# EasyEDA Pro project stm32_无人机.eprj, schematic 飞控板

## Sheets
1 MCU: Board Name: Board1; Create Date: 2025-11-24; Page Name: MCU; Project Name: stm32_无人机; Schematic Name: 飞控板; Update Date: 2025-11-25; Company: 嘉立创EDA; Page Size: A4; Version: V1.0
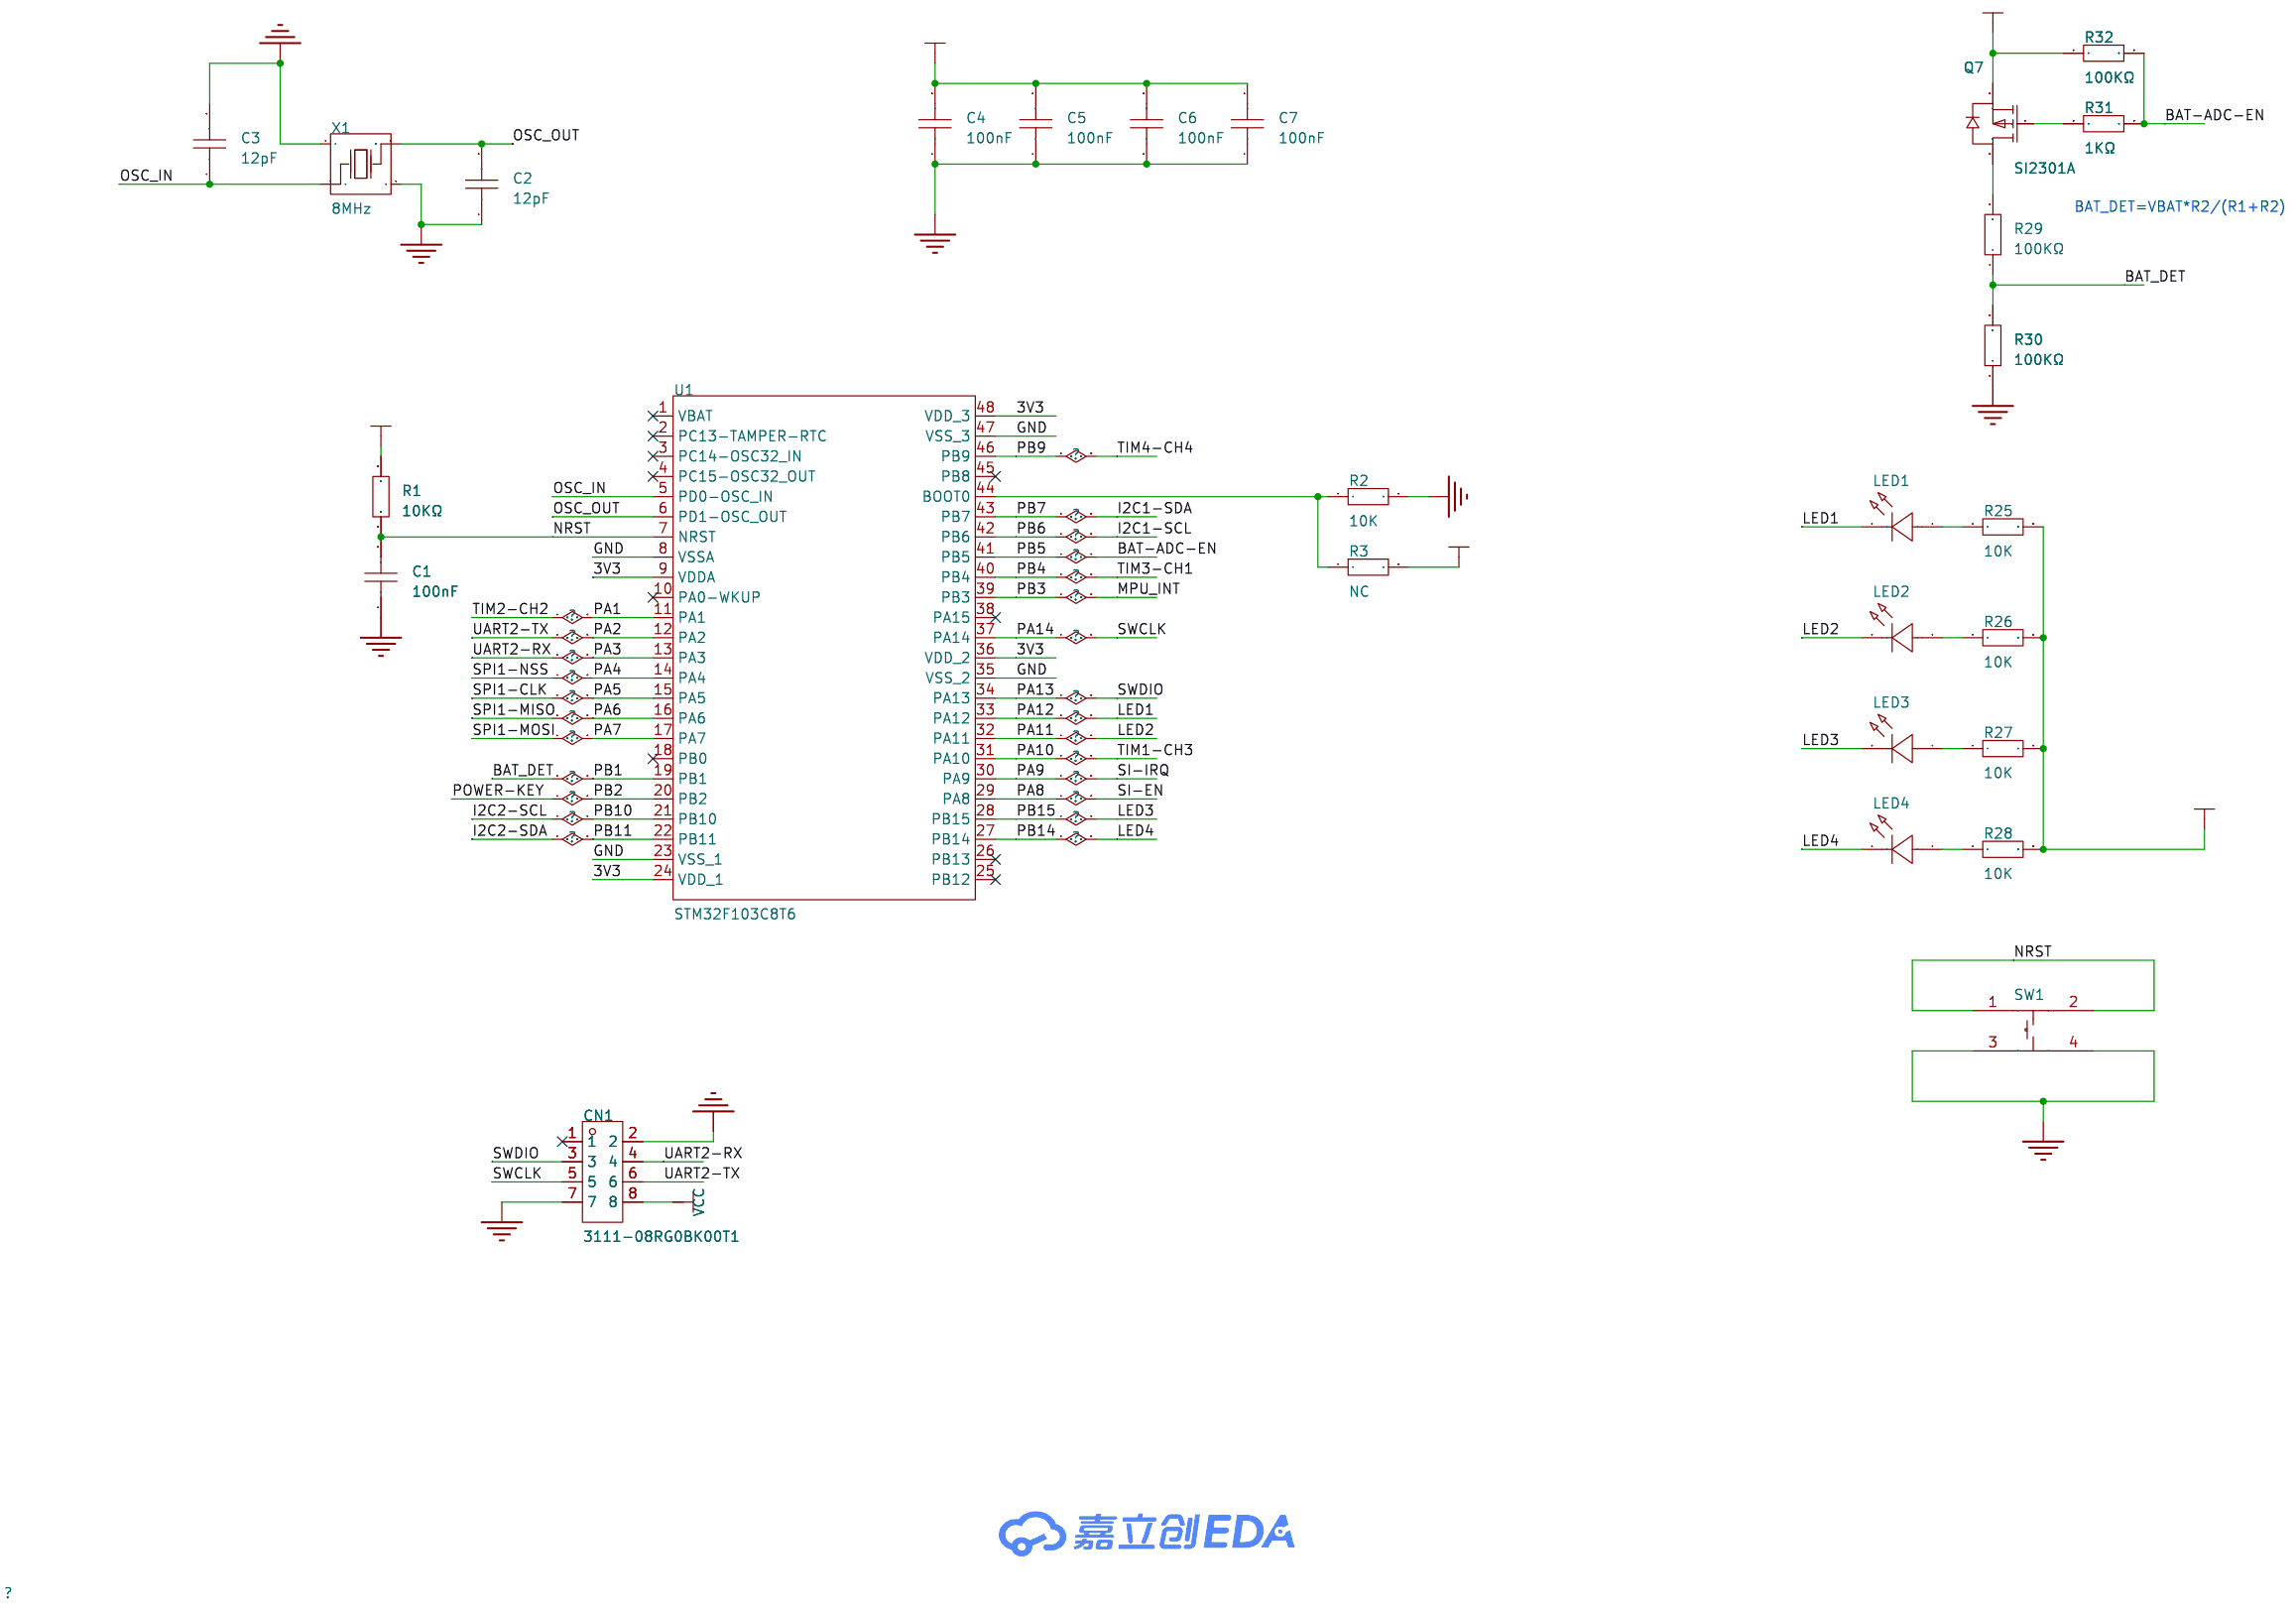
[diagram p0: MCU]
2 MPU6050: Create Date: 2025-11-25; Page Name: MPU6050
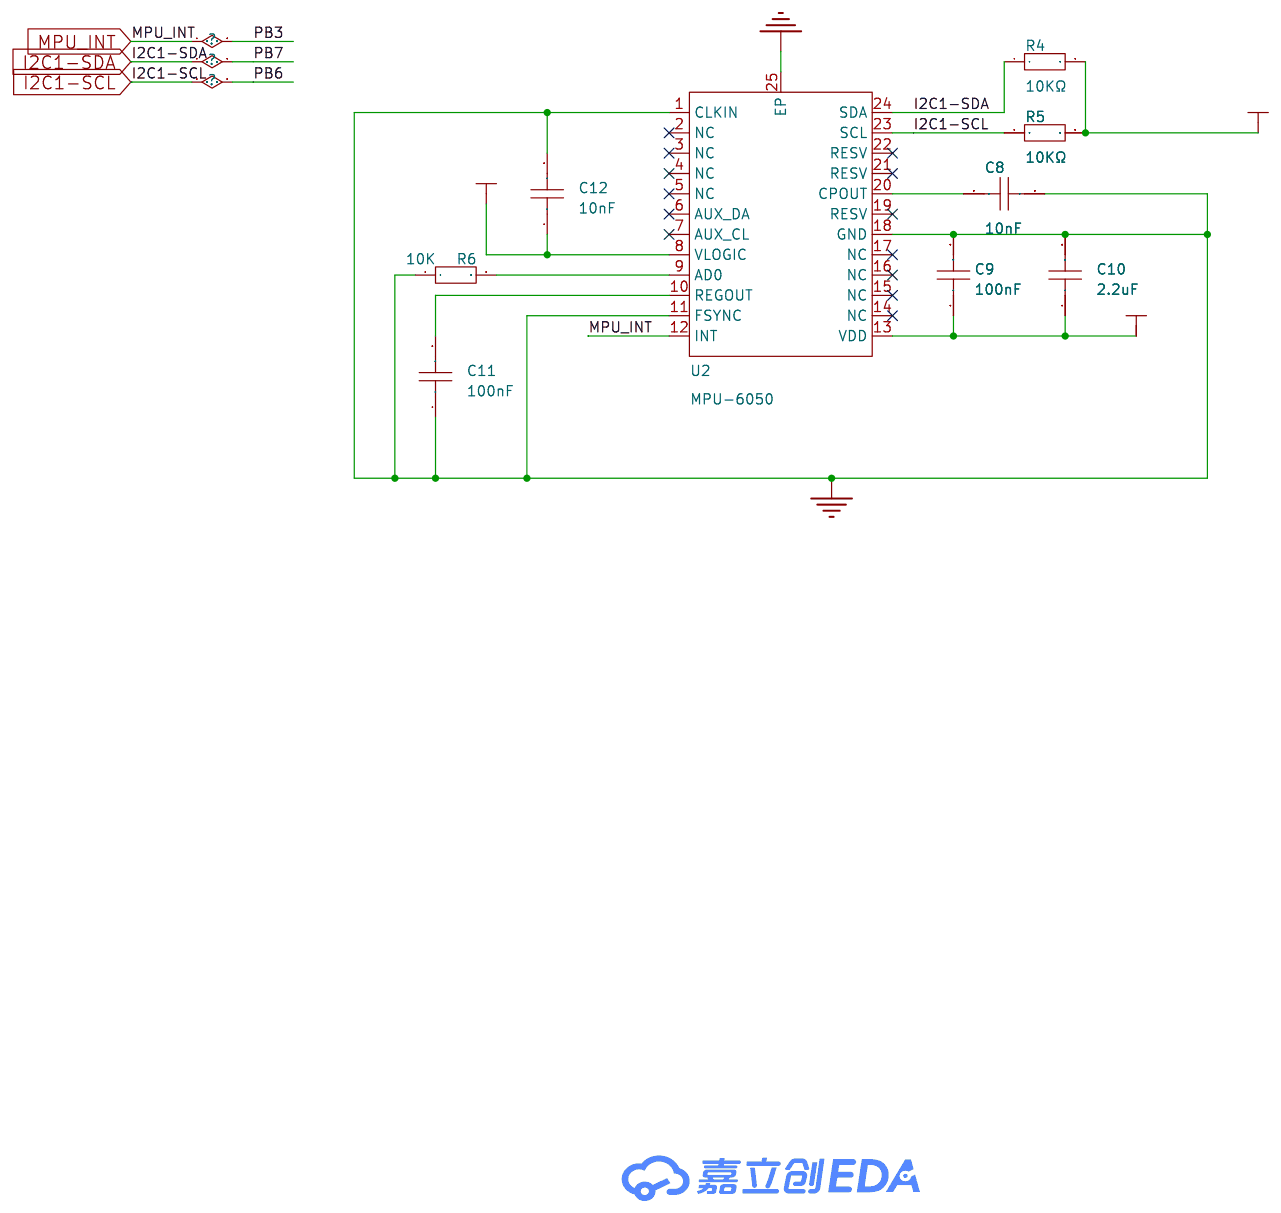
[diagram p1: MPU6050]
3 SI24R1: Create Date: 2025-11-25; Page Name: SI24R1
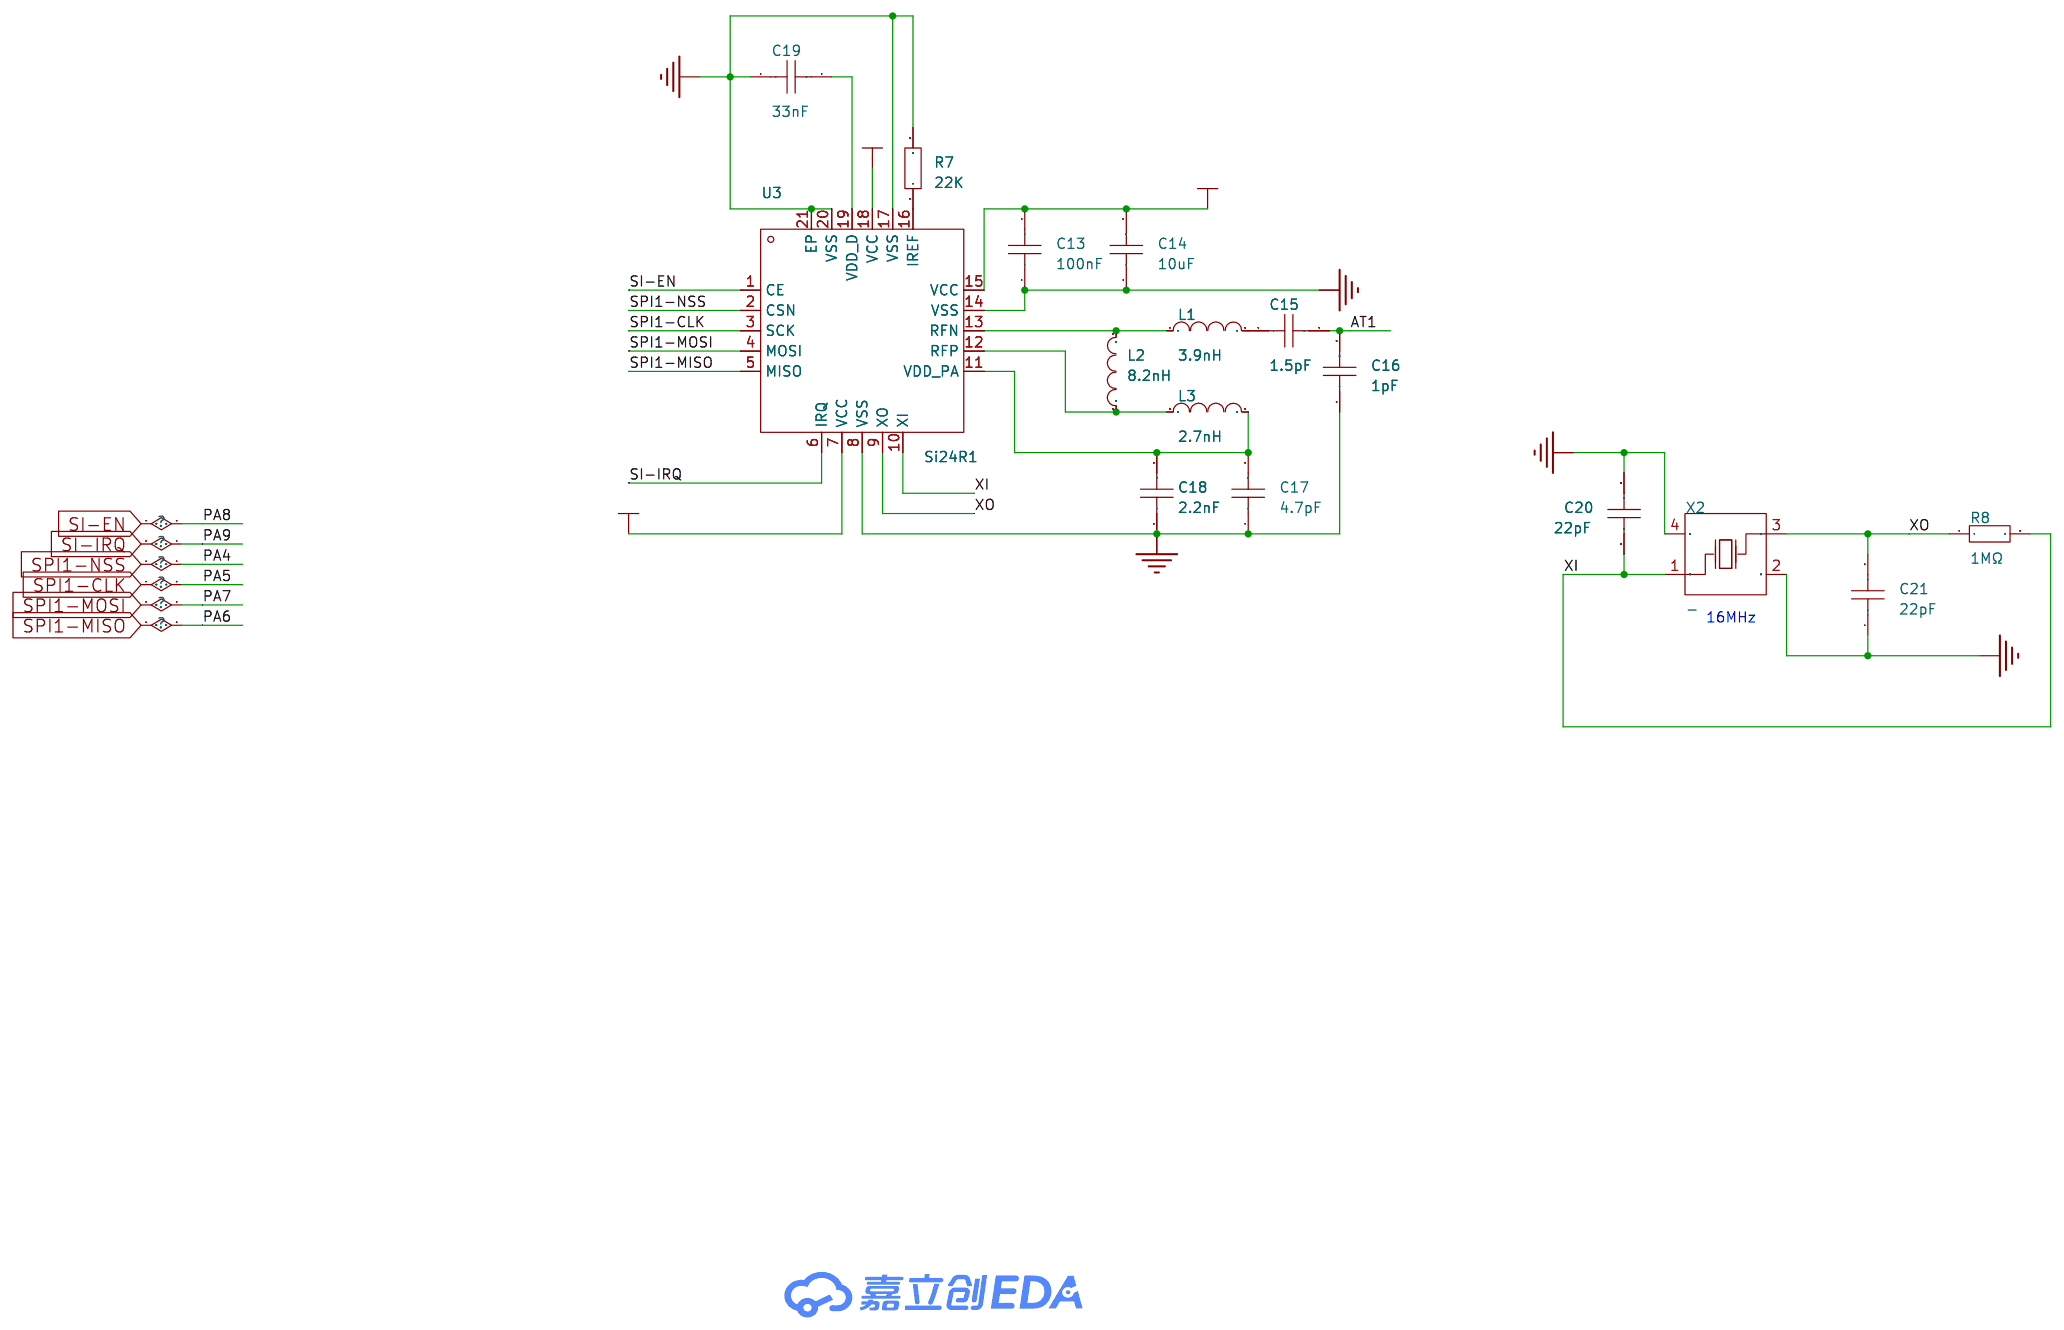
[diagram p2: SI24R1]
4 激光测高VL53: Create Date: 2025-11-25; Page Name: 激光测高VL53
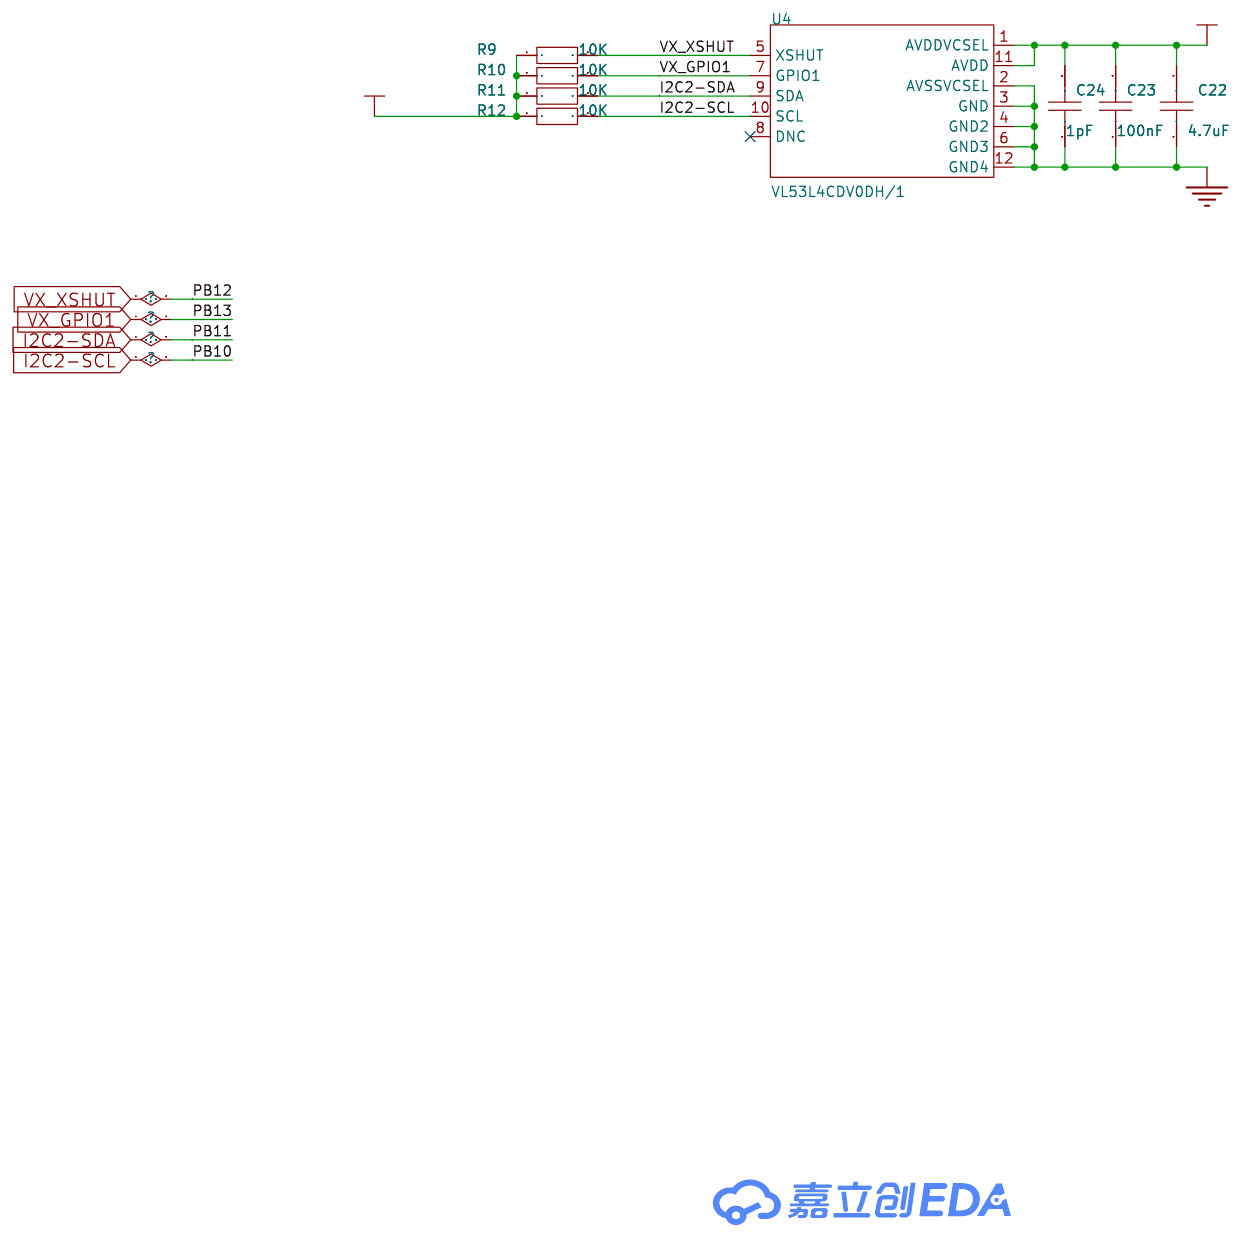
[diagram p3: 激光测高VL53]
5 电源充电管理: Create Date: 2025-11-25; Page Name: 电源充电管理
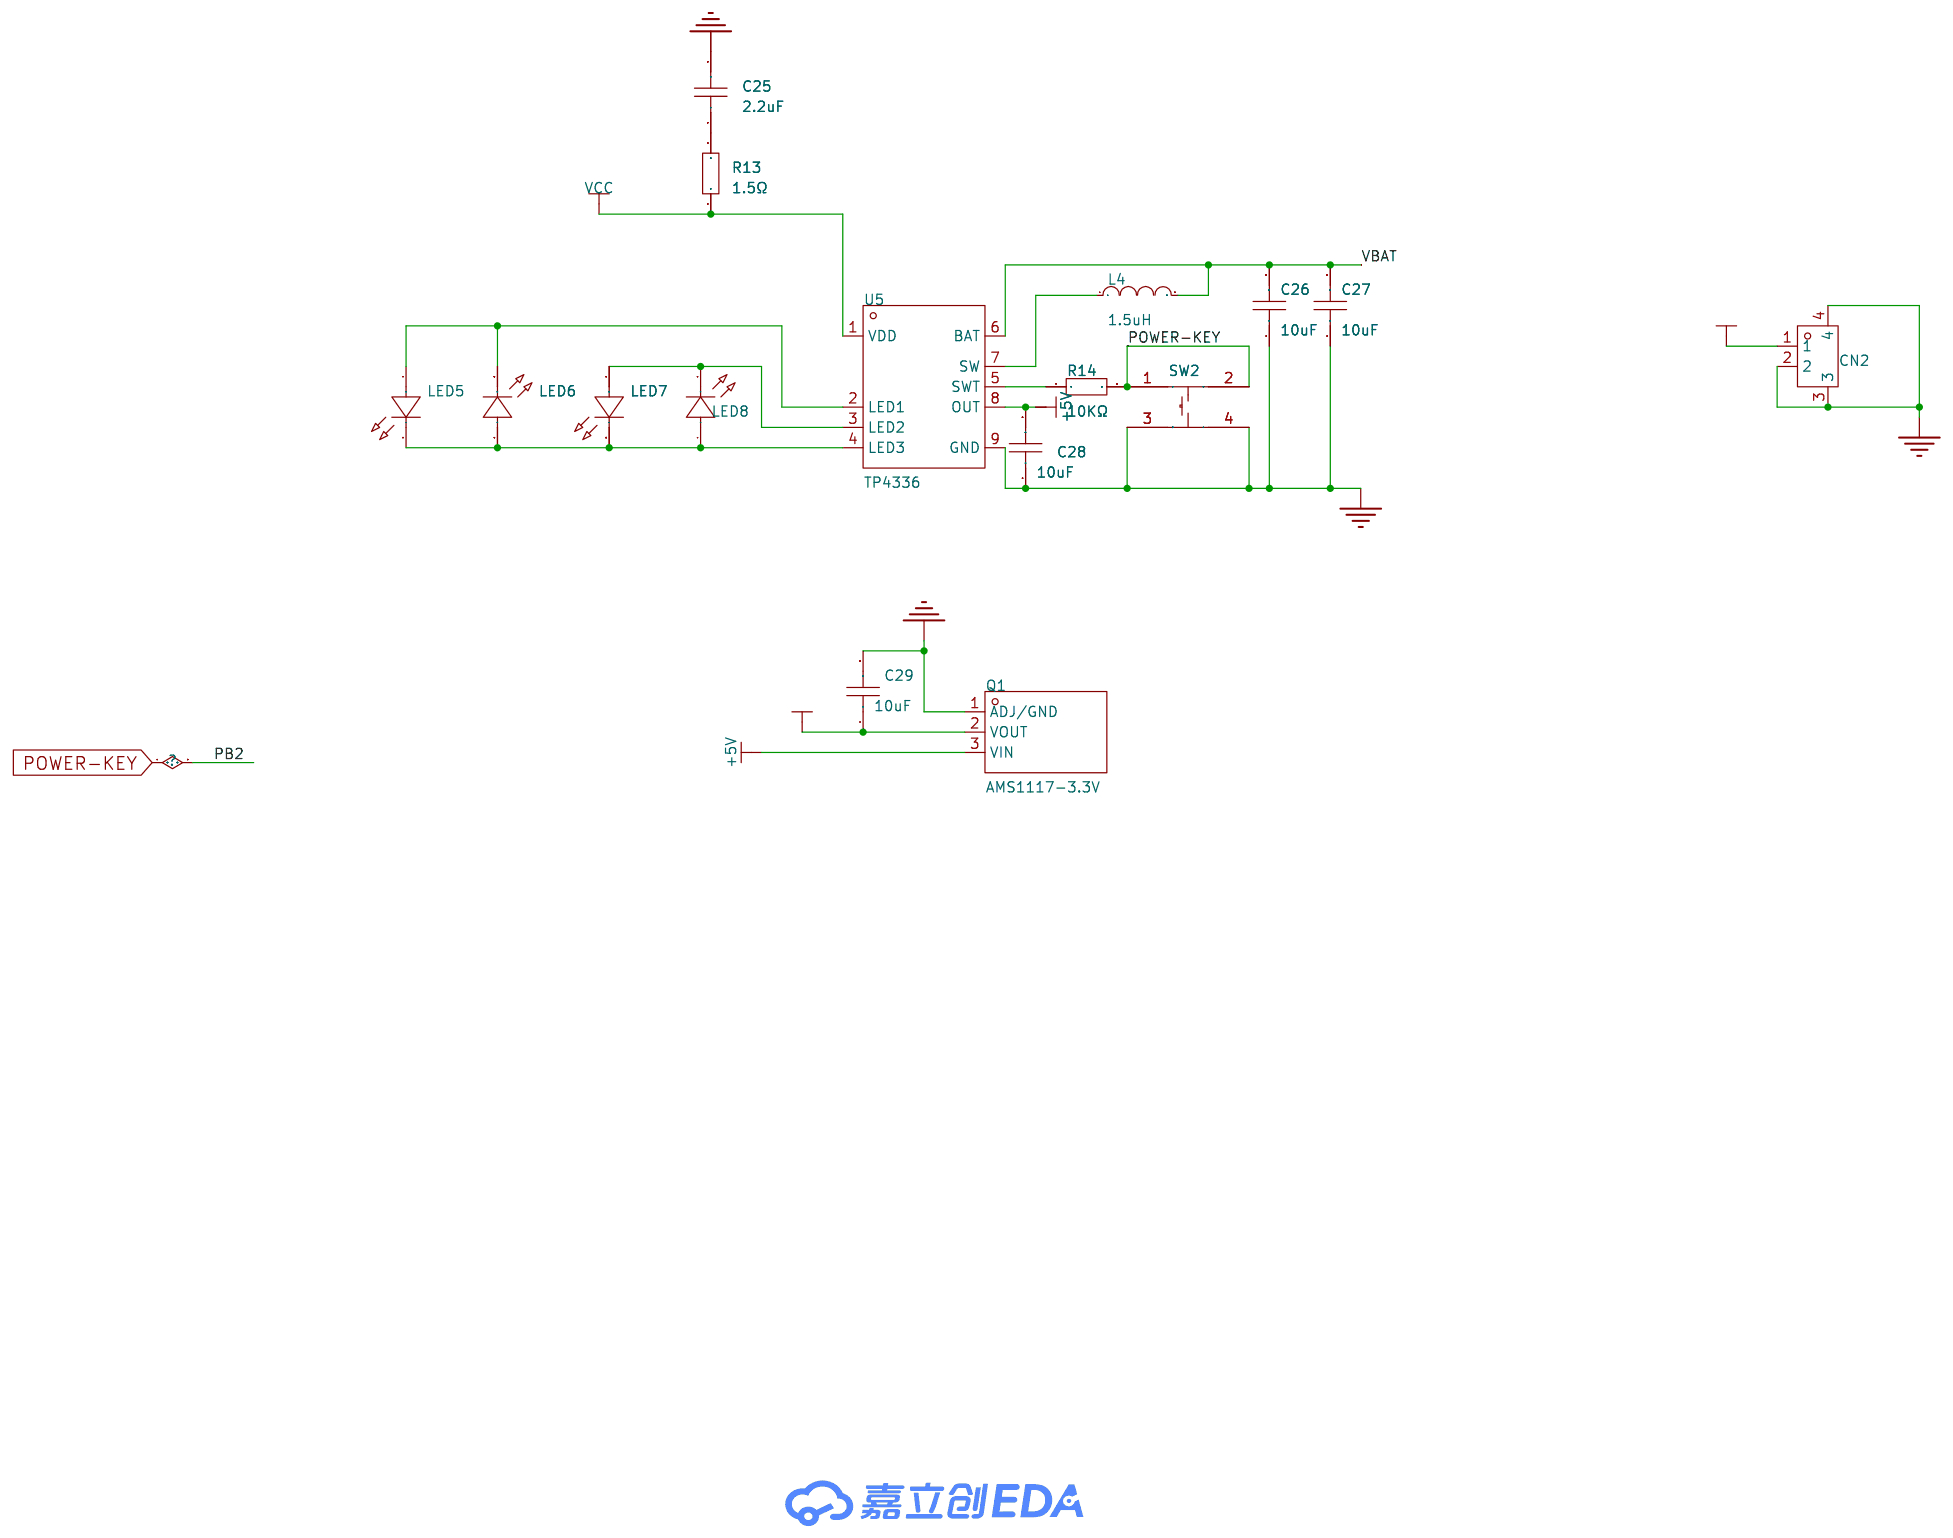
[diagram p4: 电源充电管理]
6 电机驱动: Create Date: 2025-11-25; Page Name: 电机驱动
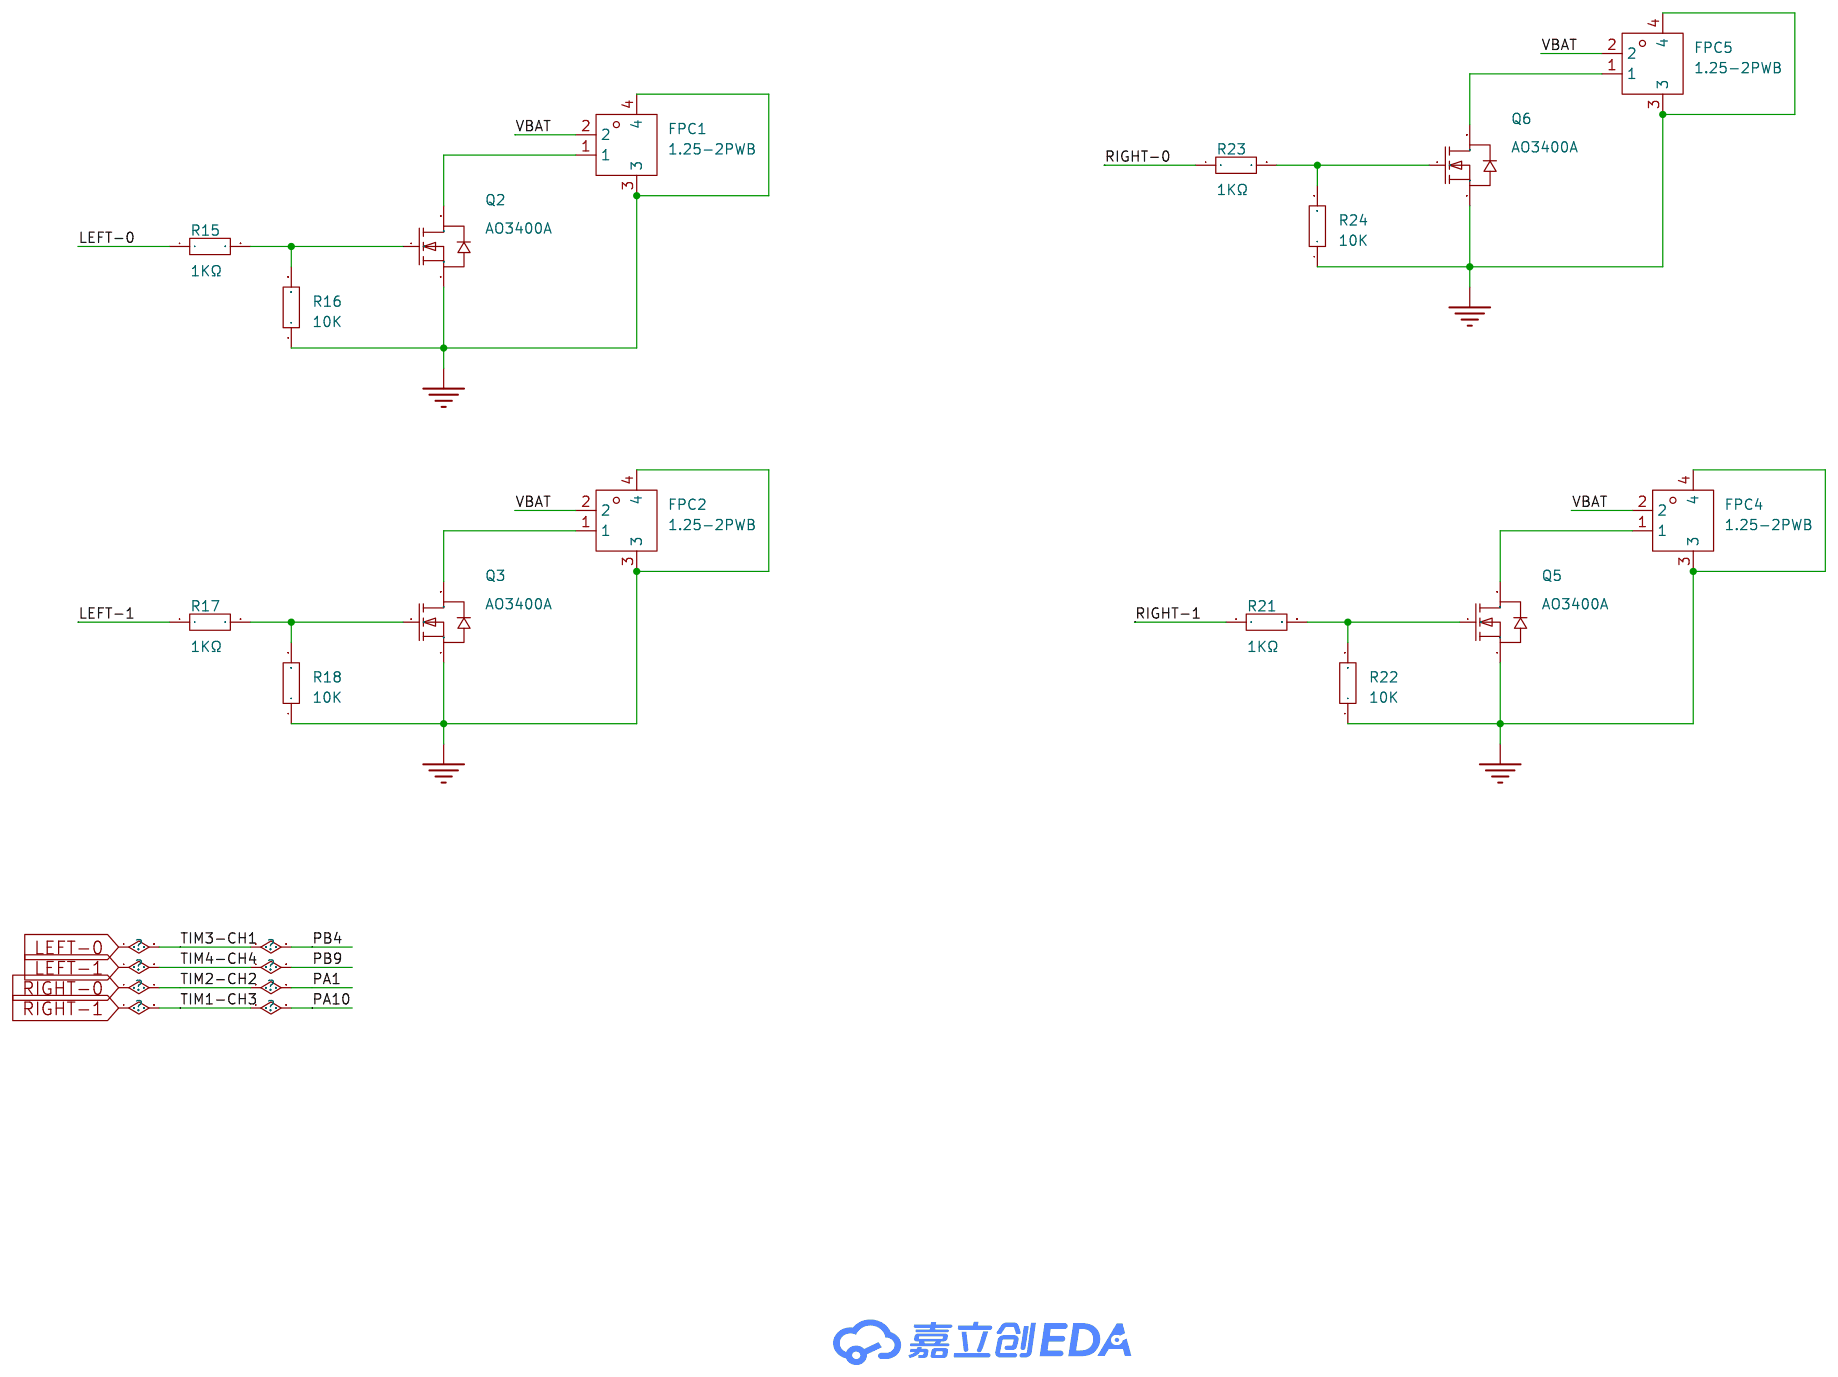
[diagram p5: 电机驱动]

## Parts
sheet MCU
C1  100nF  [C0603]
C2  12pF  [C0603]
C3  12pF  [C0603]
C4  100nF  [C0603]
C5  100nF  [C0603]
C6  100nF  [C0603]
C7  100nF  [C0603]
CN1  3111-08RG0BK00T1  [CONN-TH_3111-08RG0BK00T1]
LED1  XL-1005UYC  [LED0402-FD_YELLOW]
LED2  XL-1005UYC  [LED0402-FD_YELLOW]
LED3  XL-1005UYC  [LED0402-FD_YELLOW]
LED4  XL-1005UYC  [LED0402-FD_YELLOW]
Q7  SI2301A  [SOT-23-3_L2.9-W1.3-P1.90-LS2.4-BR]
R1  10KΩ  [R0603]
R2  10K  [R0603]
R3  NC  [R0603]
R25  10K  [R0603]
R26  10K  [R0603]
R27  10K  [R0603]
R28  10K  [R0603]
R29  100KΩ  [R0603]
R30  100KΩ  [R0603]
R31  1KΩ  [R0603]
R32  100KΩ  [R0603]
SW1  SKRPACE010  [KEY-SMD_4P-L4.2-W3.2-P2.20-LS4.6]
U1  STM32F103C8T6  [LQFP-48_L7.0-W7.0-P0.50-LS9.0-BL]
X1  8MHz  [CRYSTAL-SMD_4P-L3.2-W2.5-BL]
sheet MPU6050
C8  10nF  [C0603]
C9  100nF  [C0603]
C10  2.2uF  [C0603]
C11  100nF  [C0603]
C12  10nF  [C0603]
R4  10KΩ  [R0603]
R5  10KΩ  [R0603]
R6  10K  [R0603]
U2  MPU-6050  [QFN-24_L4.0-W4.0-P0.50-BL-EP2.7]
sheet SI24R1
C13  100nF  [C0603]
C14  10uF  [C0603]
C15  1.5pF  [C0603]
C16  1pF  [C0603]
C17  4.7pF  [C0603]
C18  2.2nF  [C0603]
C19  33nF  [C0603]
C20  22pF  [C0603]
C21  22pF  [C0603]
L1  3.9nH  [L0603]
L2  8.2nH  [L0603]
L3  2.7nH  [L0603]
R7  22K  [R0603]
R8  1MΩ  [R0603]
U3  Si24R1  [QFN-20_L4.0-W4.0-P0.50-BL-EP]
X2  -  [CRYSTAL-SMD_4P-L2.5-W2.0-BL-2]
sheet 激光测高VL53
C22  4.7uF  [C0603]
C23  100nF  [C0603]
C24  1pF  [C0603]
R9  10K  [R0603]
R10  10K  [R0603]
R11  10K  [R0603]
R12  10K  [R0603]
U4  VL53L4CDV0DH/1  [LGA-12_L4.4-W2.4_VL53L0X]
sheet 电机驱动
FPC1  1.25-2PWB  [CONN-SMD_2P-P1.25_DEALON_1.25-2PWB]
FPC2  1.25-2PWB  [CONN-SMD_2P-P1.25_DEALON_1.25-2PWB]
FPC4  1.25-2PWB  [CONN-SMD_2P-P1.25_DEALON_1.25-2PWB]
FPC5  1.25-2PWB  [CONN-SMD_2P-P1.25_DEALON_1.25-2PWB]
Q2  AO3400A  [SOT-23-3_L2.9-W1.3-P1.90-LS2.4-BR]
Q3  AO3400A  [SOT-23-3_L2.9-W1.3-P1.90-LS2.4-BR]
Q5  AO3400A  [SOT-23-3_L2.9-W1.3-P1.90-LS2.4-BR]
Q6  AO3400A  [SOT-23-3_L2.9-W1.3-P1.90-LS2.4-BR]
R15  1KΩ  [R0603]
R16  10K  [R0603]
R17  1KΩ  [R0603]
R18  10K  [R0603]
R21  1KΩ  [R0603]
R22  10K  [R0603]
R23  1KΩ  [R0603]
R24  10K  [R0603]
sheet 电源充电管理
C25  2.2uF  [C0603]
C26  10uF  [C0603]
C27  10uF  [C0603]
C28  10uF  [C0603]
C29  10uF  [C0603]
CN2  ZX-XH2.54-2PWT  [CONN-SMD_2P-P2.54_MEGASTAR_ZX-XH2.54-2PWT]
L4  1.5uH  [L0603]
LED5  XL-1005UYC  [LED0402-FD_YELLOW]
LED6  XL-1005UYC  [LED0402-FD_YELLOW]
LED7  XL-1005UYC  [LED0402-FD_YELLOW]
LED8  XL-1005UYC  [LED0402-FD_YELLOW]
Q1  AMS1117-3.3V  [SOT-89-3_L4.5-W2.5-P1.50-LS4.2-BR]
R13  1.5Ω  [R0603]
R14  10KΩ  [R0603]
SW2  SKRPACE010  [KEY-SMD_4P-L4.2-W3.2-P2.20-LS4.6]
U5  TP4336  [ESOP-8_L4.9-W3.9-P1.27-LS6.0-BL-EP-1]

## Library data of the parts
C1-C29 = CAP_0603: Supplier Footprint: 0603
CN1 = 3111-08RG0BK00T1: LCSC Part Name: 2mm 2x4P 排数:2 每排P数:4; Supplier Part: C720751; Manufacturer: Wcon(维峰电子); Supplier Footprint: 弯插,P=2mm; JLCPCB Part Class: 扩展库; Datasheet: https://atta.szlcsc.com/upload/public/pdf/source/20200908/C720751_429ECEF3D5B5C4289EC4F86089830CA0.pdf; Supplier: LCSC; Connector Type: 简牛座; Pitch: 2mm; Structure: 2x4P; Holder Type: 弯插; Row Spacing: 2mm; Number of Rows: 2; Pin Number in each Row: 4; Contact Material: 黄铜; Contact Plating: 金
LED1-LED8 = XL-1005UYC_C25503856: LCSC Part Name: 0402黄光贴片式发光二极管; Supplier Part: C25503856; Manufacturer: XINGLIGHT(成兴光); Supplier Footprint: 0402; JLCPCB Part Class: 扩展库; Datasheet: https://item.szlcsc.com/datasheet/XL-1005UYC/27234970.html; Supplier: LCSC; Illumination Color: 黄色; Voltage - Forward(Vf): 2.4V; Power(Watts): 50mW; Forward Current: 20mA; Wavelength - Dominant: 585nm~595nm; Peak Wavelength: 590nm; Luminous Intensity: 210mcd; Viewing Angle: 120°; Operating Temperature: -40℃~+85℃
Q7 = SI2301A: LCSC Part Name: 1个P沟道 耐压:20V 电流:2.8A; Supplier Part: C347482; Manufacturer: UMW(友台半导体); Supplier Footprint: SOT-23; JLCPCB Part Class: 扩展库; Datasheet: https://item.szlcsc.com/datasheet/SI2301A/324142.html; Supplier: LCSC; Number: 1个P沟道; Drain to Source Voltage: 20V; Current - Continuous Drain(Id): 2.8A; RDS(on): 90mΩ@4.5V；110mΩ@2.5V; Pd - Power Dissipation: 400mW; Gate Threshold Voltage (Vgs(th)): 1V@250uA; Gate Charge(Qg): 5.5nC@4.5V；3.3nC@2.5V; Input Capacitance(Ciss): 405pF; Reverse Transfer Capacitance (Crss@Vds): 55pF; Operating Temperature: -55℃~+150℃; Type: P沟道; Output Capacitance(Coss): 75pF
R1-R18 R21-R32 = Res_0603: Supplier Footprint: 0603
SW1 SW2 = SKRPACE010: LCSC Part Name: 4.2*3.2*2.5mm 立贴 轻触开关; Supplier Part: C139797; Manufacturer: ALPSALPINE(阿尔卑斯阿尔派); Supplier Footprint: SMD-4P,4.2x3.2mm; JLCPCB Part Class: 扩展库; Datasheet: https://item.szlcsc.com/datasheet/SKRPACE010/151122.html; Supplier: LCSC; Circuit: 单刀单掷; Actuator Style: 椭圆形按钮; Mounting Type: 立贴; Length: 4.2mm; Width: 3.2mm; Switch Height: 2.5mm; Contact Current: 50mA; Voltage Rating: 16V
U1 = STM32F103C8T6: LCSC Part Name: 主流增强型ARM Cortex-M3 MCU，具有64 KB Flash、72 MHz CPU、电机控制、USB和CAN; Supplier Part: C8734; Manufacturer: ST(意法半导体); Supplier Footprint: LQFP-48(7x7); JLCPCB Part Class: 扩展库; Datasheet: https://item.szlcsc.com/datasheet/STM32F103C8T6/9243.html; Supplier: LCSC; CPU Core: ARM-M3; CPU Maximum Speed: 72MHz; Program Storage Size: 64KB; Program Memory Type: FLASH; Number of I/O: 37; ADC (Bit): 12bit; Voltage - Supply: 2V~3.6V
X1 = TAXM8M4RDBCCT2T: LCSC Part Name: 8MHz ±10ppm 10pF; Supplier Part: C400090; Manufacturer: YJX(雅晶鑫); Supplier Footprint: SMD3225-4P; JLCPCB Part Class: 扩展库; Datasheet: https://item.szlcsc.com/datasheet/TAXM8M4RDBCCT2T/383475.html; Supplier: LCSC; Type: 贴片晶振; Normal temperature Frequency Tolerance: ±10ppm; Load Capacitance: 10pF; Frequency Stability: ±15ppm; Equivalent Series Resistance(ESR): 250Ω; Operating Temperature: -40℃~+85℃
U2 = MPU-6050: Supplier Part: C24112; Manufacturer: TDK InvenSense(应美盛); Supplier Footprint: QFN-24-EP(4x4); JLCPCB Part Class: 扩展库; Datasheet: https://item.szlcsc.com/datasheet/MPU-6050/24852.html; Supplier: LCSC; Sensor Type: 加速度计陀螺仪; Operating Temperature: -40℃~+85℃
L1-L4 = L_0603
U3 = Si24R1: LCSC Part Name: 超低功耗、高性能2.4 GHz GFSK收发器; Supplier Part: C14436; Manufacturer: 南京中科微; Supplier Footprint: QFN-20-EP(4x4); JLCPCB Part Class: 扩展库; Datasheet: https://item.szlcsc.com/datasheet/Si24R1/15098.html; Supplier: LCSC; Frequency Range: 2.4GHz~2.525GHz; Interface: SPI; Voltage - Supply: 1.9V~3.6V; Applications: ISM; Output Power: 7dBm; Data Rate: 2Mbps; Current Of Transmitting: 12mA; Sensitivity: -96dBm; Receive Current: 15mA; Typical Application Frequency: 2.4GHz; Operating Temperature: -40℃~+85℃; Type: 收发器
X2 = SX25Y016000B91T: LCSC Part Name: 2520 16M 9PF  10ppm  -20 -75℃; Supplier Part: C271644; Manufacturer: TKD(泰晶); Supplier Footprint: SMD2520-4P; JLCPCB Part Class: 扩展库; Datasheet: https://item.szlcsc.com/datasheet/SX25Y016000B91T/260707.html; Supplier: LCSC
U4 = VL53L4CDV0DH/1: LCSC Part Name: I2C接口的飞行时间高精度接近传感器; Supplier Part: C3178291; Manufacturer: ST(意法半导体); Supplier Footprint: SMD-12P; JLCPCB Part Class: 扩展库; Datasheet: https://atta.szlcsc.com/upload/public/pdf/source/20221107/BE9994483FC65BEC03A9A3E978A2D9BD.pdf; Supplier: LCSC; Supply Voltage: 2.6V~3.5V; Iinearity Range: 0cm~130cm; Supply Current: 24mA
FPC1 FPC2 FPC4 FPC5 = 1.25-2PWB: LCSC Part Name: 1x2P 间距:1.25mm 卧贴 系列:PicoBlade(MX 1.25); Supplier Part: C2905009; Manufacturer: DEALON(德艺隆); Supplier Footprint: SMD,P=1.25mm,卧贴; JLCPCB Part Class: 扩展库; Datasheet: https://item.szlcsc.com/datasheet/1.25-2PWB/3172294.html; Supplier: LCSC; Pins Structure: 1x2P; Pitch: 1.25mm; Mounting Type: 卧贴; Reference Series: PicoBlade(MX 1.25); Number of Pins: 2P; Number of Rows: 1; Number of PINs Per Row: 2; Current Rating: 1A; Contact Material: 黄铜; Contact Plating: 锡; Operating Temperature: -25℃~+85℃; Voltage Rating: 125V; Plastic Material: LCP; Flame Retardant Rating: UL94V-0; Supplementary Features: 辅助焊脚; Color: 米色
Q2 Q3 Q5 Q6 = AO3400A_C347475: LCSC Part Name: 1个N沟道 耐压:30V 电流:5.8A; Supplier Part: C347475; Manufacturer: UMW(友台半导体); Supplier Footprint: SOT-23; JLCPCB Part Class: 扩展库; Datasheet: https://item.szlcsc.com/datasheet/AO3400A/324135.html; Supplier: LCSC; Number: 1个N沟道; Drain to Source Voltage: 30V; Current - Continuous Drain(Id): 5.8A; RDS(on): 17mΩ@10V; Pd - Power Dissipation: 1.4W; Gate Threshold Voltage (Vgs(th)): 1.1V@250uA; Gate Charge(Qg): 9.7nC@4.5V; Input Capacitance(Ciss): 823pF; Reverse Transfer Capacitance (Crss@Vds): 77pF; Operating Temperature: -55℃~+150℃; Output Capacitance(Coss): 99pF
CN2 = ZX-XH2.54-2PWT: LCSC Part Name: 1x2P 间距:2.5mm 卧贴 系列:XH; Supplier Part: C7429671; Manufacturer: Megastar(兆星); Supplier Footprint: SMD,P=2.5mm,卧贴; JLCPCB Part Class: 扩展库; Datasheet: https://item.szlcsc.com/datasheet/ZX-XH2.54-2PWT/8427588.html; Supplier: LCSC; Pins Structure: 1x2P; Pitch: 2.5mm; Mounting Type: 卧贴; Reference Series: XH; Number of Pins: 2P; Number of Rows: 1; Number of PINs Per Row: 2; Current Rating: 3A; Contact Material: 黄铜; Contact Plating: 锡; Operating Temperature: -25℃~+85℃; Voltage Rating: 250V; Plastic Material: LCP; Supplementary Features: 辅助焊脚; Color: 米色; Z-Height of the Board: 6.2mm; X-Length of Bottom Edge on Board (Spacing Line): 10mm; Y-Width of Bottom Edge on Board: 7.8mm
Q1 = AMS1117-3.3V_C5120796: LCSC Part Name: 输入18V 输出3.3V 1A; Supplier Part: C5120796; Manufacturer: MSKSEMI(美森科); Supplier Footprint: SOT-89; JLCPCB Part Class: 扩展库; Datasheet: https://item.szlcsc.com/datasheet/AMS1117-3.3V/5706251.html; Supplier: LCSC; Output Type: 固定; Voltage - Supply: 18V; Output Voltage: 3.3V; Output Current: 1A; Voltage Dropout: 1.4V@(1A); standby current: 12mA; Operating Temperature: 0℃~+125℃; Output Configuration: 正极; Number of Outputs: 1
U5 = TP4336: Supplier Part: C29075510; Manufacturer: TPOWER(天源); Supplier Footprint: ESOP-8L; JLCPCB Part Class: 扩展库; Datasheet: https://item.szlcsc.com/datasheet/TP4336/30801980.html; Supplier: LCSC

## Nets
3V3: C4.2 C5.2 C6.2 C7.2 C9.1 C10.1 C12.1 C13.2 C14.2 C22.2 C23.2 C24.2 C29.1 Q1.2(VOUT) R1.2 R3.2 R4.2 R5.2 R9.1 R10.1 R11.1 R12.1 R25.2 R26.2 R27.2 R28.2 U1.9(VDDA) U1.24(VDD_1) U1.36(VDD_2) U1.48(VDD_3) U2.8(VLOGIC) U2.13(VDD) U3.7(VCC) U3.15(VCC) U3.18(VCC) U4.1(AVDDVCSEL) U4.11(AVDD)
+5V: C28.2 Q1.3(VIN) U5.8(OUT)
GND: C1.1 C2.1 C3.2 C4.1 C5.1 C6.1 C7.1 C8.2 C9.2 C10.2 C11.1 C12.2 C13.1 C14.1 C16.1 C17.1 C18.1 C19.1 C20.2 C21.1 C22.1 C23.1 C24.1 C25.2 C26.1 C27.1 C28.1 C29.2 CN1.2 CN1.7 CN2.2 CN2.3 CN2.4 FPC1.3 FPC1.4 FPC2.3 FPC2.4 FPC4.3 FPC4.4 FPC5.3 FPC5.4 Q1.1(ADJ/GND) Q2.2(S) Q3.2(S) Q5.2(S) Q6.2(S) R2.2 R6.1 R7.2 R16.1 R18.1 R22.1 R24.1 R30.1 SW1.3 SW1.4 SW2.3 SW2.4 U1.8(VSSA) U1.23(VSS_1) U1.35(VSS_2) U1.47(VSS_3) U2.1(CLKIN) U2.11(FSYNC) U2.18(GND) U2.25(EP) U3.8(VSS) U3.14(VSS) U3.17(VSS) U3.20(VSS) U3.21(EP) U4.2(AVSSVCSEL) U4.3(GND) U4.4(GND2) U4.6(GND3) U4.12(GND4) U5.9(GND) X1.2 X1.4 X2.2(GND) X2.4(GND)
VBAT: C26.2 C27.2 CN2.1 FPC1.2 FPC2.2 FPC4.2 FPC5.2 L4.2 Q7.2(S) R32.1 U5.6(BAT)
VCC: CN1.8 R13.1 U5.1(VDD)
AT1: C15.2 C16.2
BAT-ADC-EN: R31.2 R32.2 U1.41(PB5)
BAT_DET: R29.1 R30.2 U1.19(PB1)
I2C1-SCL: R5.1 U1.42(PB6) U2.23(SCL)
I2C1-SDA: R4.1 U1.43(PB7) U2.24(SDA)
I2C2-SCL: R12.2 U1.21(PB10) U4.10(SCL)
I2C2-SDA: R11.2 U1.22(PB11) U4.9(SDA)
LED1: LED1.2(K) U1.33(PA12)
LED2: LED2.2(K) U1.32(PA11)
LED3: LED3.2(K) U1.28(PB15)
LED4: LED4.2(K) U1.27(PB14)
LEFT-0: R15.1 U1.40(PB4)
LEFT-1: R17.1 U1.46(PB9)
MPU_INT: U1.39(PB3) U2.12(INT)
NRST: C1.2 R1.1 SW1.1 SW1.2 U1.7(NRST)
OSC_IN: C3.1 U1.5(PD0-OSC_IN) X1.1
OSC_OUT: C2.2 U1.6(PD1-OSC_OUT) X1.3
PA1: R23.1 U1.11(PA1)
PA2: CN1.6 U1.12(PA2)
PA3: CN1.4 U1.13(PA3)
PA4: U1.14(PA4) U3.2(CSN)
PA5: U1.15(PA5) U3.3(SCK)
PA6: U1.16(PA6) U3.5(MISO)
PA7: U1.17(PA7) U3.4(MOSI)
PA8: U1.29(PA8) U3.1(CE)
PA9: U1.30(PA9) U3.6(IRQ)
PA10: R21.1 U1.31(PA10)
PA13: CN1.3 U1.34(PA13)
PA14: CN1.5 U1.37(PA14)
PB2: R14.2 SW2.1 SW2.2 U1.20(PB2)
PB12: R9.2 U4.5(XSHUT)
PB13: R10.2 U4.7(GPIO1)
XI: C20.1 R8.2 U3.10(XI) X2.1(OSC1)
XO: C21.2 R8.1 U3.9(XO) X2.3(OSC2)
$1N2794: LED4.1(A) R28.1
$1N2801: LED1.1(A) R25.1
$1N2810: LED2.1(A) R26.1
$1N2814: LED3.1(A) R27.1
$1N3111: Q7.3(D) R29.2
$1N3224: Q7.1(G) R31.1
$2N428: C8.1 U2.20(CPOUT)
$2N624: C11.2 U2.10(REGOUT)
$2N708: R6.2 U2.9(AD0)
$3N804: L1.1 L2.2 U3.13(RFN)
$3N836: C15.1 L1.2
$3N1010: L2.1 L3.1 U3.12(RFP)
$3N1134: C17.2 C18.2 L3.2 U3.11(VDD_PA)
$3N1431: R7.1 U3.16(IREF)
$3N1484: C19.2 U3.19(VDD_D)
$5N366: LED5.2(K) LED6.1(A) LED7.2(K) LED8.1(A) U5.4(LED3)
$5N397: LED7.1(A) LED8.2(K) U5.3(LED2)
$5N414: LED5.1(A) LED6.2(K) U5.2(LED1)
$5N509: C25.1 R13.2
$5N790: L4.1 U5.7(SW)
$5N872: R14.1 U5.5(SWT)
$6N230: FPC1.1 Q2.3(D)
$6N326: Q2.1(G) R15.2 R16.2
$6N594: FPC2.1 Q3.3(D)
$6N597: Q3.1(G) R17.2 R18.2
$6N982: FPC4.1 Q5.3(D)
$6N985: Q5.1(G) R21.2 R22.2
$6N1176: FPC5.1 Q6.3(D)
$6N1179: Q6.1(G) R23.2 R24.2
Net-(R2-1): R2.1 R3.1 U1.44(BOOT0)

Not connected (* = marked no-connect by the designer): CN1 1*; U1 1(VBAT)* 2(PC13-TAMPER-RTC)* 3(PC14-OSC32_IN)* 4(PC15-OSC32_OUT)* 10(PA0-WKUP)* 18(PB0)* 25(PB12)* 26(PB13)* 38(PA15)* 45(PB8)*; U2 2(NC)* 3(NC)* 4(NC)* 5(NC)* 6(AUX_DA)* 7(AUX_CL)* 14(NC)* 15(NC)* 16(NC)* 17(NC)* 19(RESV)* 21(RESV)* 22(RESV)*; U4 8(DNC)*

## Notes on the sheets
sheet 1
- BAT_DET=VBAT*R2/(R1+R2)
sheet 3
- 16MHz
